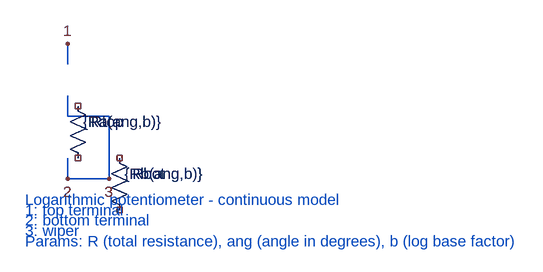
[diagram p0: schematic pot_log.asc]
pot_log.asc, the LTspice schematic file:
Version 4
SHEET 1 880 680
WIRE 80 64 80 32
WIRE 80 144 80 112
WIRE 144 144 80 144
WIRE 144 192 144 144
WIRE 80 240 80 208
WIRE 144 240 144 192
WIRE 144 240 80 240
FLAG 80 32 1
FLAG 80 240 2
FLAG 144 240 3
SYMBOL res 80 112 R0
WINDOW 3 24 40 Left 2
SYMATTR InstName Rtop
SYMATTR Value {Ra(ang,b)}
SYMBOL res 144 192 R0
WINDOW 3 24 40 Left 2
SYMATTR InstName Rbot
SYMATTR Value {Rb(ang,b)}
TEXT 8 272 Left 2 ; Logarithmic potentiometer - continuous model
TEXT 8 288 Left 2 ; 1: top terminal
TEXT 8 304 Left 2 ; 2: bottom terminal
TEXT 8 320 Left 2 ; 3: wiper
TEXT 8 336 Left 2 ; Params: R (total resistance), ang (angle in degrees), b (log base factor)
.TEXT 8 352 Left 2 .SUBCKT pot_log 1 2 3 PARAMS: R=10k ang=0 b=10
.TEXT 8 368 Left 2 .FUNC F(ang,b) = log(1 + (ang / 270) * (b - 1)) / log(b)
.TEXT 8 384 Left 2 .FUNC Ra(ang,b) = R * (1 - F(ang,b))
.TEXT 8 400 Left 2 .FUNC Rb(ang,b) = R * F(ang,b)
.TEXT 8 416 Left 2 Rtop 1 3 {Ra(ang,b)}
.TEXT 8 432 Left 2 Rbot 2 3 {Rb(ang,b)}
.TEXT 8 448 Left 2 .ENDS pot_log

The netlist it stands for:
* pot_log.asc
Rtop NC_01 NC_02 {Ra(ang,b)}
Rbot NC_03 NC_04 {Rb(ang,b)}
*  Logarithmic potentiometer - continuous model
*  1: top terminal
*  2: bottom terminal
*  3: wiper
*  Params: R (total resistance), ang (angle in degrees), b (log base factor)
.backanno
.end